# Altium schematic sheet [3]-GLCD_128X64.SchDoc: [3]-GLCD_128X64
size A3; DocumentNumber: 3; Revision: 01-01-2020; SheetNumber: 3; SheetTotal: 6
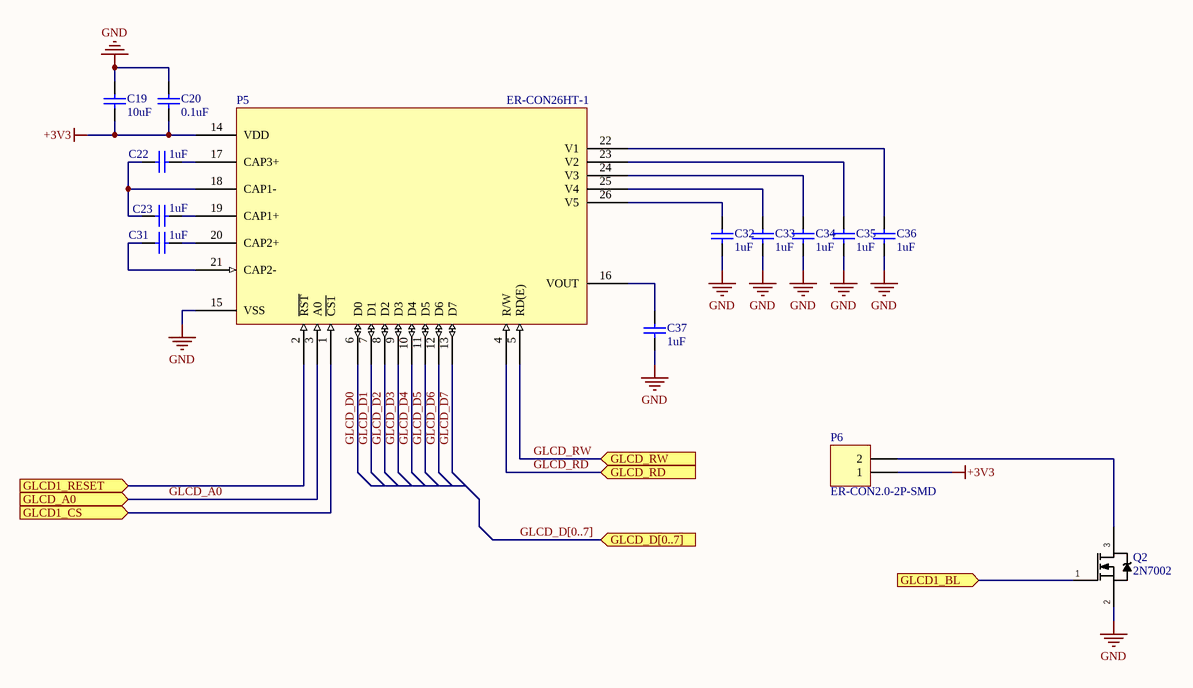
[diagram p0: [3]-GLCD_128X64.SchDoc]

## Parts
C19  10uF  [CAPC1608N]
C20  0.1uF  [CAPC1608N]
C22  1uF  [CAPC1608N]
C23  1uF  [CAPC1608N]
C31  1uF  [CAPC1608N]
C32  1uF  [CAPC1608N]
C33  1uF  [CAPC1608N]
C34  1uF  [CAPC1608N]
C35  1uF  [CAPC1608N]
C36  1uF  [CAPC1608N]
C37  1uF  [CAPC1608N]
P5  ER-CON26HT-1  [ER-CON26HT-1]
P6  ER-CON2.0-2P-SMD  [ER-CON2.0-2P-SMD]
Q2  2N7002  [SOT23-3N]

## Ports
GLCD1_BL (in), GLCD1_CS (in), GLCD1_RESET (in), GLCD_A0 (in), GLCD_D[0..7] (in), GLCD_RD (in), GLCD_RW (in)

## Nets
+3V3: C19.1 C20.1 P5.14(VDD) P6.1
GND: C19.2 C20.2 C32.1 C33.1 C34.1 C35.1 C36.1 C37.1 P5.15(VSS) Q2.2(S)
GLCD1_BL: Q2.1(G) ; port GLCD1_BL
GLCD1_CS: P5.1(~{CS1}) ; port GLCD1_CS
GLCD1_RESET: P5.2(~{RST}) ; port GLCD1_RESET
GLCD_A0: P5.3(A0) ; port GLCD_A0
GLCD_D0: P5.6(D0)
GLCD_D1: P5.7(D1)
GLCD_D2: P5.8(D2)
GLCD_D3: P5.9(D3)
GLCD_D4: P5.10(D4)
GLCD_D5: P5.11(D5)
GLCD_D6: P5.12(D6)
GLCD_D7: P5.13(D7)
GLCD_RD: P5.4(R/W) ; port GLCD_RD
GLCD_RW: P5.5(RD(E)) ; port GLCD_RW
NetC22_1: C22.1 C23.1 P5.18(CAP1-)
NetC22_2: C22.2 P5.17(CAP3+)
NetC23_2: C23.2 P5.19(CAP1+)
NetC31_1: C31.1 P5.21(CAP2-)
NetC31_2: C31.2 P5.20(CAP2+)
NetC32_2: C32.2 P5.26(V5)
NetC33_2: C33.2 P5.25(V4)
NetC34_2: C34.2 P5.24(V3)
NetC35_2: C35.2 P5.23(V2)
NetC36_2: C36.2 P5.22(V1)
NetC37_2: C37.2 P5.16(VOUT)
NetP6_2: P6.2 Q2.3(D)

## Buses and harness runs
bus GLCD_D[0..7] = port GLCD_D[0..7]

## Library data of the parts
C19 = GRM188R61A106KE69D: CAP CER 10UF 10V X5R 0603; Manufacturer 1: Murata; Tolerance: 10%; Supplier 1: Digi-Key; Manufacturer Part Number 1: GRM188R61A106KE69D; Stock 1: 40000; Pricing 1: 1=0.22, 10=0.149, 100=0.0754, 500=0.05158, 1000=0.04563 (USD); Mount: Surface Mount; Case/Package: 0603; Case Code (Metric): 1608; Case Code (Imperial): 0603; Min Operating Temperature: -55°C; Max Operating Temperature: 85°C; Capacitance: 10uF; Packaging: Tape and Reel; Dielectric: X5R; Voltage Rating: 10V; Voltage: 10V; Voltage Rating (DC): 10V; Length: 1.6mm; Height: 0.8mm; Width: 0.031inch; Thickness: 0.037inch; Depth: 0.8mm; REACH SVHC: No SVHC; Lead Free: Lead Free; Supplier Part Number 1: 490-10474-1-ND
C20 = CC0603KRX7R8BB104: CAP CER 0.1UF 25V X7R 0603; Manufacturer 1: Yageo; Capacitance: 100nF; Tolerance: 10%; Supplier 1: Digi-Key; Manufacturer Part Number 1: CC0603KRX7R8BB104; Stock 1: 40000; Pricing 1: 1=0.1, 10=0.074, 100=0.0329, 500=0.02352, 1000=0.01848 (USD); Mount: Surface Mount; Case/Package: 0603; Number of Pins: 2; Case Code (Imperial): 0603; Case Code (Metric): 1608; Min Operating Temperature: -55°C; Max Operating Temperature: 125°C; Dielectric: X7R; Voltage Rating: 25V; Packaging: Tape and Reel; Package Quantity: 1; Voltage Rating (DC): 25V; Termination: SMD/SMT; Composition: Ceramic; Voltage: 25V; Length: 1.6mm; Height: 0.8mm; Width: 0.8mm; Thickness: 0.035inch; Depth: 0.8mm; Radiation Hardening: No; REACH SVHC: Unknown; Lead Free: Lead Free; Halogen Free: Halogen Free; ComponentLink1URL: https://datasheet.ciiva.com/11786/0900766b80c10176-11786120.pdf; ComponentLink1Description: https://datasheet.ciiva.com/11786/0900766b80c10176-11786120.pdf; ComponentLink2URL: https://datasheet.ciiva.com/144/mlccorderingcode-144075.pdf; ComponentLink2Description: https://datasheet.ciiva.com/144/mlccorderingcode-144075.pdf; ComponentLink3URL: https://datasheet.ciiva.com/17434/upy-gphc-x7r-6-3v-to-50v-8-17434263.pdf; ComponentLink3Description: https://datasheet.ciiva.com/17434/upy-gphc-x7r-6-3v-to-50v-8-17434263.pdf; ComponentLink4URL: https://datasheet.ciiva.com/26829/getdatasheetpartid-403577-26829431.pdf; ComponentLink4Description: https://datasheet.ciiva.com/26829/getdatasheetpartid-403577-26829431.pdf; ComponentLink5URL: https://datasheet.ciiva.com/11587/upy-gphc-x7r-6-3v-to-50v-8-11587208.pdf; ComponentLink5Description: https://datasheet.ciiva.com/11587/upy-gphc-x7r-6-3v-to-50v-8-11587208.pdf; ComponentLink6URL: https://datasheet.ciiva.com/13389/upy-gphc-x7r-6-3v-to-50v-8-13389352.pdf; ComponentLink6Description: https://datasheet.ciiva.com/13389/upy-gphc-x7r-6-3v-to-50v-8-13389352.pdf; ComponentLink7URL: https://datasheet.ciiva.com/28450/1489800-28450584.pdf; ComponentLink7Description: https://datasheet.ciiva.com/28450/1489800-28450584.pdf; ComponentLink8URL: https://datasheet.ciiva.com/144/mlccorderingcode-144073.pdf; ComponentLink8Description: https://datasheet.ciiva.com/144/mlccorderingcode-144073.pdf; ComponentLink9URL: https://datasheet.ciiva.com/144/mlccorderingcode-144074.pdf; ComponentLink9Description: https://datasheet.ciiva.com/144/mlccorderingcode-144074.pdf; ComponentLink10URL: https://datasheet.ciiva.com/7978/1489800-7978155.pdf; ComponentLink10Description: https://datasheet.ciiva.com/7978/1489800-7978155.pdf; Supplier Part Number 1: 311-1341-1-ND
C22 C23 C31-C37 = CL10A105KL8NNNC: CAP CER 1UF 35V X5R 0603; Manufacturer 1: Samsung; Description 1: 1µF ±10% 35V X5R Ceramic Capacitor -55°C ~ 85°C Surface Mount, MLCC 0603 (1608 Metric) 0.063" L x 0.031" W (1.60mm x 0.80mm); Capacitance: 1 µF; Tolerance (%): ±10 %; Supplier 1: Digi-Key; Manufacturer Part Number 1: CL10A105KL8NNNC; Stock 1: 65224; Pricing 1: 1=0.16, 10=0.117, 100=0.055, 500=0.0386, 1000=0.0319 (USD); Case Size/Dimension: 0603; Dielectric: X5R; Rated Voltage: 35 V; ComponentLink1URL: https://datasheet.ciiva.com/25773/cl10a105kl8nnnc-25773809.pdf; ComponentLink1Description: https://datasheet.ciiva.com/25773/cl10a105kl8nnnc-25773809.pdf; ComponentLink2URL: https://datasheet.ciiva.com/16202/clseries-16202344.pdf; ComponentLink2Description: https://datasheet.ciiva.com/16202/clseries-16202344.pdf; Supplier Part Number 1: 1276-1861-1-ND
P5 = ER-CON26HT-1: CONN ZIF 26 TOP PIN SMT
P6 = ER-CON2.0-2P-SMD: CONN 2 POS SMD 2MM PITCH
Q2 = 2N7002: MOSFET N-CH 60V 115MA SOT-23; Manufacturer 1: ON Semiconductor / Fairchild; Max Power Dissipation: 200mW; Drain to Source Resistance: 1.2R; Gate to Source Voltage (Vgs): 20V; Nominal Vgs: 2.1V; Number of Elements: 1; Element Configuration: Single; Input Capacitance: 50pF; Rds On Max: 7.5R; On-State Resistance: 5.3R; Supplier 1: Digi-Key; Manufacturer Part Number 1: 2N7002; Stock 1: 111118; Pricing 1: 1=0.33, 10=0.304, 100=0.17, 500=0.09108, 1000=0.06193 (USD); Mount: Surface Mount; Case/Package: SOT-23; Number of Pins: 3; Contact Plating: Tin,Matte; Min Operating Temperature: -55°C; Max Operating Temperature: 150°C; Continuous Drain Current (ID): 115mA; Packaging: Tape and Reel; Package Quantity: 1; Drain to Source Voltage (Vdss): 60V; Drain to Source Breakdown Voltage: 60V; Power Dissipation: 200mW; Threshold Voltage: 2.1V; Voltage Rating (DC): 60V; Current Rating: 115mA; Dual Supply Voltage: 60V; Current: 115mA; Voltage: 60V; Length: 2.92mm; Height: 0.93mm; Width: 3.05mm; Radiation Hardening: No; REACH SVHC: No SVHC; Lead Free: Lead Free; ComponentLink1URL: https://datasheet.ciiva.com/931/2n7000-931777.pdf; ComponentLink1Description: https://datasheet.ciiva.com/931/2n7000-931777.pdf; ComponentLink2URL: https://datasheet.ciiva.com/27746/47-0120-27746881.pdf; ComponentLink2Description: https://datasheet.ciiva.com/27746/47-0120-27746881.pdf; ComponentLink3URL: https://datasheet.ciiva.com/1254/2n7002-1254451.pdf; ComponentLink3Description: https://datasheet.ciiva.com/1254/2n7002-1254451.pdf; ComponentLink4URL: https://datasheet.ciiva.com/15137/getdatasheetpartid-93547-15137771.pdf; ComponentLink4Description: https://datasheet.ciiva.com/15137/getdatasheetpartid-93547-15137771.pdf; ComponentLink5URL: https://datasheet.ciiva.com/931/2n7000-931762.pdf; ComponentLink5Description: https://datasheet.ciiva.com/931/2n7000-931762.pdf; ComponentLink6URL: https://datasheet.ciiva.com/931/2n7000-931763.pdf; ComponentLink6Description: https://datasheet.ciiva.com/931/2n7000-931763.pdf; ComponentLink7URL: https://datasheet.ciiva.com/931/2n7000-931764.pdf; ComponentLink7Description: https://datasheet.ciiva.com/931/2n7000-931764.pdf; ComponentLink8URL: https://datasheet.ciiva.com/1254/660093-1254452.pdf; ComponentLink8Description: https://datasheet.ciiva.com/1254/660093-1254452.pdf; ComponentLink9URL: https://datasheet.ciiva.com/1188/660093-1188359.pdf; ComponentLink9Description: https://datasheet.ciiva.com/1188/660093-1188359.pdf; ComponentLink10URL: https://datasheet.ciiva.com/1188/660093-1188361.pdf; ComponentLink10Description: https://datasheet.ciiva.com/1188/660093-1188361.pdf; ComponentLink11URL: https://datasheet.ciiva.com/17007/2n7002-17007243.pdf; ComponentLink11Description: https://datasheet.ciiva.com/17007/2n7002-17007243.pdf; ComponentLink12URL: https://datasheet.ciiva.com/3304/nds7002a-3304380.pdf; ComponentLink12Description: https://datasheet.ciiva.com/3304/nds7002a-3304380.pdf; ComponentLink13URL: https://datasheet.ciiva.com/3304/nds7002a-3304381.pdf; ComponentLink13Description: https://datasheet.ciiva.com/3304/nds7002a-3304381.pdf; ComponentLink14URL: https://datasheet.ciiva.com/22655/660093-22655230.pdf; ComponentLink14Description: https://datasheet.ciiva.com/22655/660093-22655230.pdf; Supplier Part Number 1: 2N7002NCT-ND